# EAGLE schematic KB_Board_schematic (EAGLE 9.7.0)
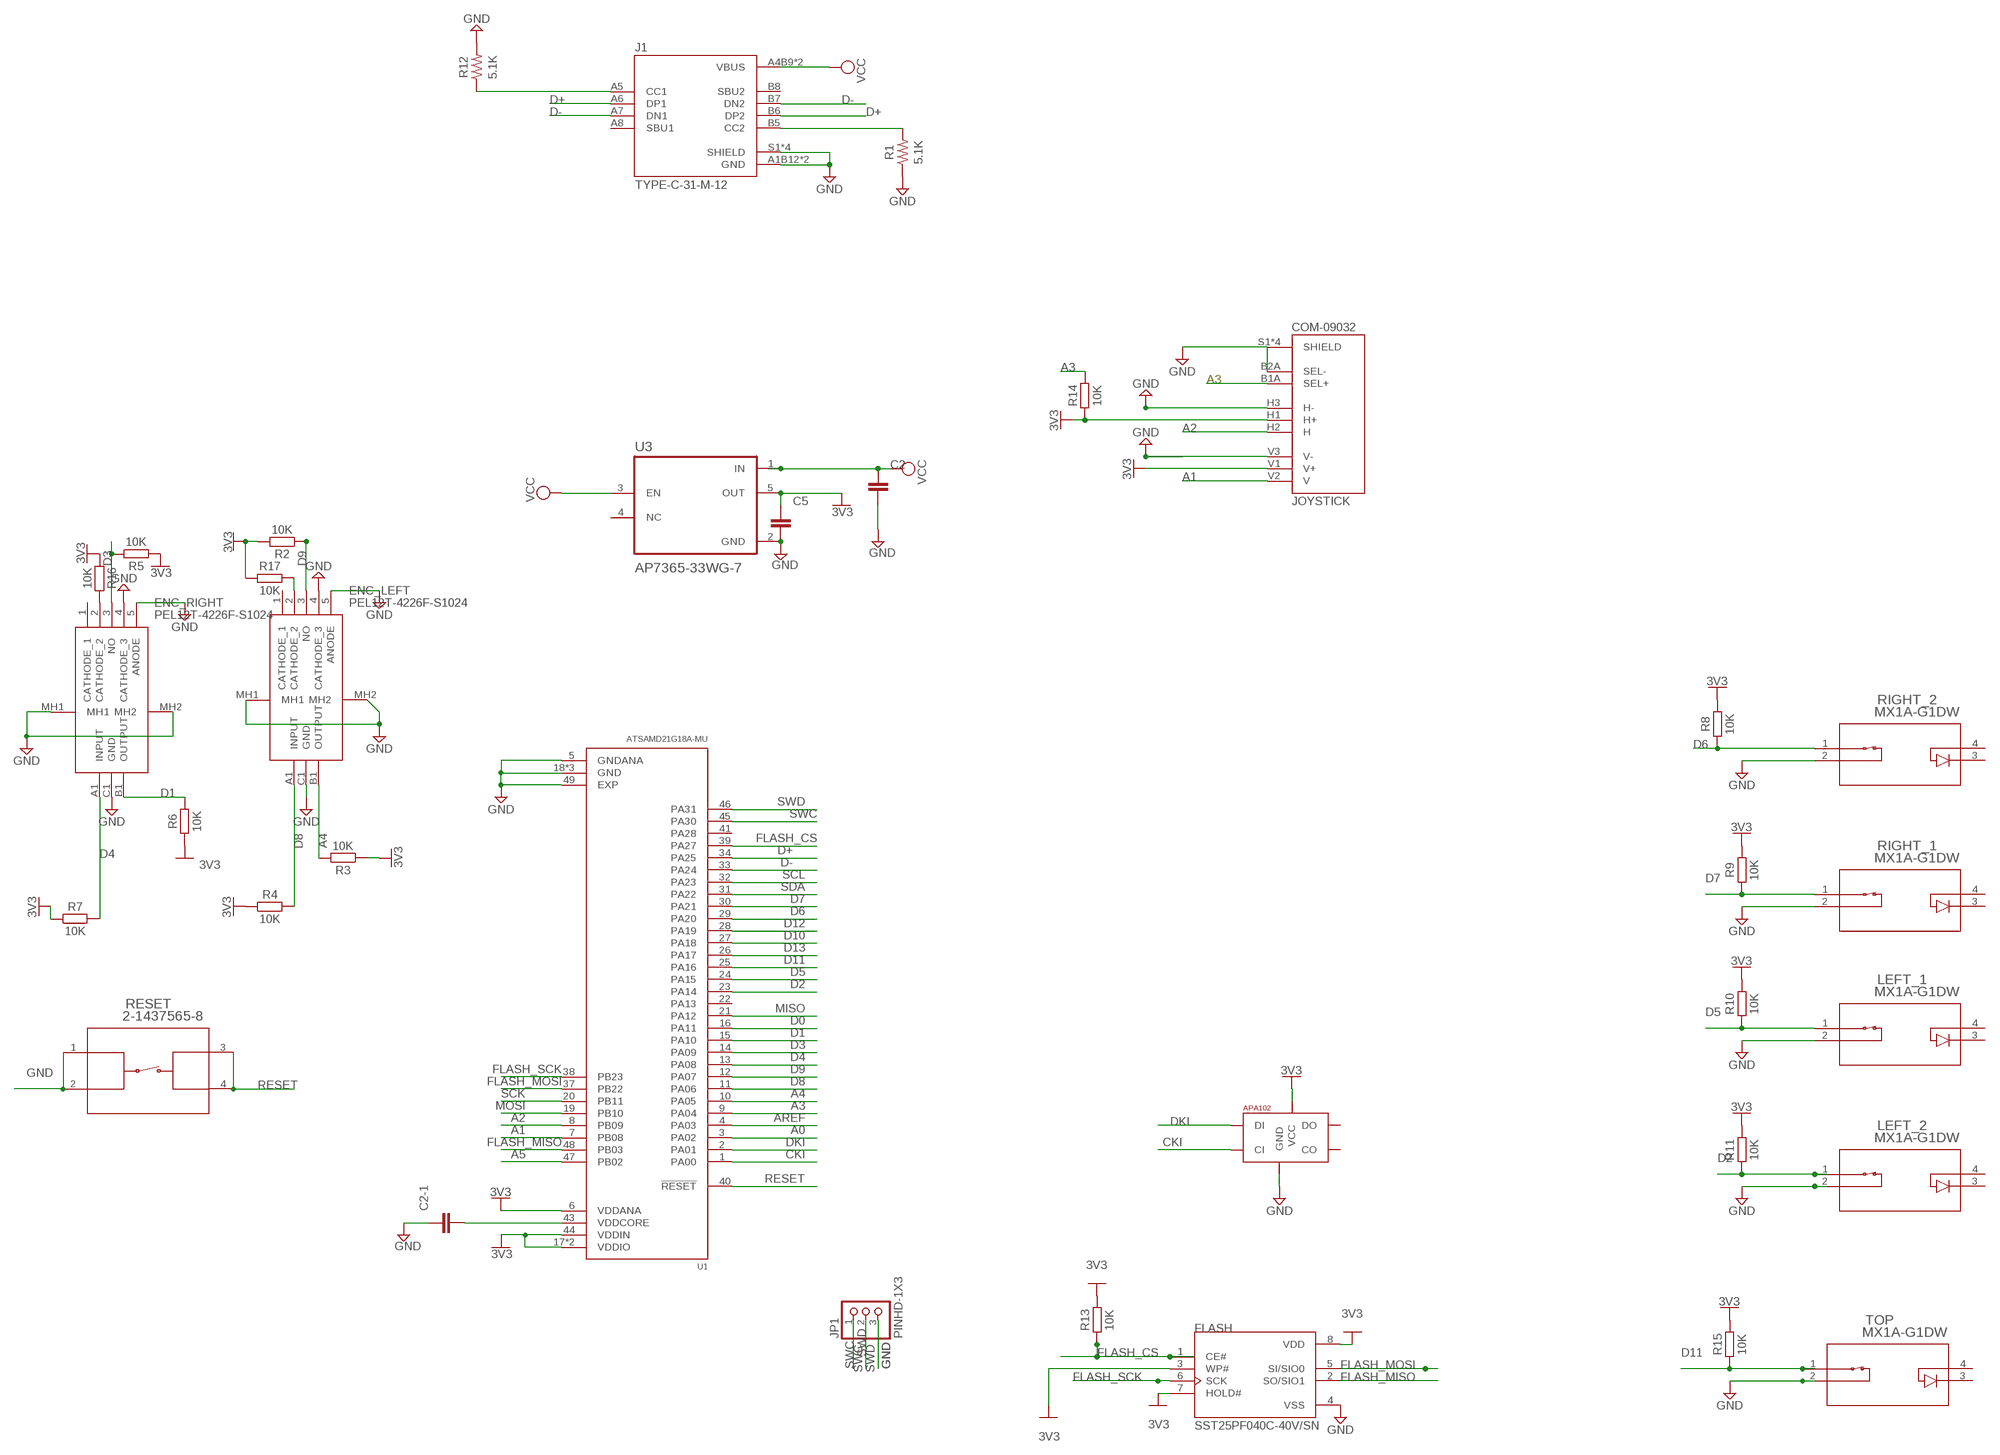
[diagram p0: schematic, sheet 1]

## Parts
C2  C_CHIP-0805(2012-METRIC)  [CAPC2012X110]
C2-1  C_CHIP-0805(2012-METRIC)  [CAPC2012X110]
C5  C_CHIP-0805(2012-METRIC)  [CAPC2012X110]
ENC_LEFT  PEL12T-4226F-S1024  [PEL12T4226FS1024]
ENC_RIGHT  PEL12T-4226F-S1024  [PEL12T4226FS1024]
FLASH  SST25PF040C-40V/SN  [SOIC8]
J1  TYPE-C-31-M-12  [HRO_TYPE-C-31-M-12]
JOYSTICK  COM-09032  [XDCR_COM-09032]
JP1  PINHD-1X3  [1X03]
LEFT_1  MX1A-G1DW  [MX1A-G1DW_CHY]
LEFT_2  MX1A-G1DW  [MX1A-G1DW_CHY]
R1  5.1K  R-US_CHIP-0402(1005-METRIC)  [RESC1005X40]
R2  10K  R_CHIP-0603(1608-METRIC)  [RESC1608X60]
R3  10K  R_CHIP-0603(1608-METRIC)  [RESC1608X60]
R4  10K  R_CHIP-0603(1608-METRIC)  [RESC1608X60]
R5  10K  R_CHIP-0603(1608-METRIC)  [RESC1608X60]
R6  10K  R_CHIP-0603(1608-METRIC)  [RESC1608X60]
R7  10K  R_CHIP-0603(1608-METRIC)  [RESC1608X60]
R8  10K  R_CHIP-0603(1608-METRIC)  [RESC1608X60]
R9  10K  R_CHIP-0603(1608-METRIC)  [RESC1608X60]
R10  10K  R_CHIP-0603(1608-METRIC)  [RESC1608X60]
R11  10K  R_CHIP-0603(1608-METRIC)  [RESC1608X60]
R12  5.1K  R-US_CHIP-0402(1005-METRIC)  [RESC1005X40]
R13  10K  R_CHIP-0603(1608-METRIC)  [RESC1608X60]
R14  10K  R_CHIP-0603(1608-METRIC)  [RESC1608X60]
R15  10K  R_CHIP-0603(1608-METRIC)  [RESC1608X60]
R16  10K  R_CHIP-0603(1608-METRIC)  [RESC1608X60]
R17  10K  R_CHIP-0603(1608-METRIC)  [RESC1608X60]
RESET  2-1437565-8  [SW4_2-1437565-7]
RIGHT_1  MX1A-G1DW  [MX1A-G1DW_CHY]
RIGHT_2  MX1A-G1DW  [MX1A-G1DW_CHY]
TOP  MX1A-G1DW  [MX1A-G1DW_CHY]
U1  ATSAMD21G18A-MU  [QFN50P700X700X90-49N]
U3  AP7365-33WG-7  [SOT95P285X140-5N]
U$1  APA1022020  [APA102_2020]

## Nets
3V3: C5.1 FLASH.3(WP#) FLASH.7(HOLD#) FLASH.8(VDD) JOYSTICK.H1(H+) JOYSTICK.V1(V+) R2.2 R3.1 R4.1 R5.2 R6.1 R7.1 R8.2 R9.2 R10.2 R11.2 R13.2 R14.1 R15.2 R16.2 R17.2 U1.6(VDDANA) U1.17(VDDIO) U1.36(VDDIO) U1.44(VDDIN) U3.5(OUT) U$1.V_CC(VCC)
A0: U1.3(PA02)
A1: JOYSTICK.V2(V) U1.7(PB08)
A2: JOYSTICK.H2(H) U1.8(PB09)
A3: JOYSTICK.B1A(SEL+) R14.2 U1.9(PA04)
A4: ENC_LEFT.B1(OUTPUT) R3.2 U1.10(PA05)
A5: U1.47(PB02)
AREF: U1.4(PA03)
CKI: U1.1(PA00) U$1.C_IN(CI)
D0: U1.16(PA11)
D1: ENC_RIGHT.B1(OUTPUT) R6.2 U1.15(PA10)
D2: LEFT_2.1 R11.1 U1.23(PA14)
D3: ENC_RIGHT.3(NO) R5.1 U1.14(PA09)
D4: ENC_RIGHT.A1(INPUT) R7.2 U1.13(PA08)
D5: LEFT_1.1 R10.1 U1.24(PA15)
D6: R8.1 RIGHT_2.1 U1.29(PA20)
D7: R9.1 RIGHT_1.1 U1.30(PA21)
D8: ENC_LEFT.A1(INPUT) R4.2 U1.11(PA06)
D9: ENC_LEFT.3(NO) R2.1 U1.12(PA07)
D10: U1.27(PA18)
D11: R15.1 TOP.1 U1.25(PA16)
D12: U1.28(PA19)
D13: U1.26(PA17)
D+: J1.A6(DP1) J1.B6(DP2) U1.34(PA25)
D-: J1.A7(DN1) J1.B7(DN2) U1.33(PA24)
DKI: U1.2(PA01) U$1.D_IN(DI)
FLASH_CS: FLASH.1(CE#) R13.1 U1.39(PA27)
FLASH_MISO: FLASH.2(SO/SIO1) U1.48(PB03)
FLASH_MOSI: FLASH.5(SI/SIO0) U1.37(PB22)
FLASH_SCK: FLASH.6(SCK) U1.38(PB23)
GND: C2-1.1 C2.2 C5.2 ENC_LEFT.4(CATHODE_3) ENC_LEFT.5(ANODE) ENC_LEFT.C1(GND) ENC_LEFT.MH1 ENC_LEFT.MH2 ENC_RIGHT.4(CATHODE_3) ENC_RIGHT.5(ANODE) ENC_RIGHT.C1(GND) ENC_RIGHT.MH1 ENC_RIGHT.MH2 FLASH.4(VSS) J1.A1B12(GND) J1.B1A12(GND) J1.S1(SHIELD) J1.S2(SHIELD) J1.S3(SHIELD) J1.S4(SHIELD) JOYSTICK.B2A(SEL-) JOYSTICK.H3(H-) JOYSTICK.S1(SHIELD) JOYSTICK.S2(SHIELD) JOYSTICK.S3(SHIELD) JOYSTICK.S4(SHIELD) JOYSTICK.V3(V-) JP1.3 LEFT_1.2 LEFT_2.2 R1.1 R12.2 RESET.1 RESET.2 RIGHT_1.2 RIGHT_2.2 TOP.2 U1.5(GNDANA) U1.18(GND) U1.35(GND) U1.42(GND) U1.49(EXP) U3.2(GND) U$1.GND
MISO: U1.21(PA12)
MOSI: U1.19(PB10)
N$1: C2-1.2 U1.43(VDDCORE)
N$2: J1.B5(CC2) R1.2
N$3: J1.A5(CC1) R12.1
N$6: ENC_RIGHT.2(CATHODE_2) R16.1
N$7: ENC_LEFT.2(CATHODE_2) R17.1
RESET: RESET.3 RESET.4 U1.40(!RESET)
SCK: U1.20(PB11)
SCL: U1.32(PA23)
SDA: U1.31(PA22)
SWC: JP1.1 U1.45(PA30)
SWD: JP1.2 U1.46(PA31)
VCC: C2.1 J1.A4B9(VBUS) J1.B4A9(VBUS) U3.1(IN) U3.3(EN)
Unconnected: ENC_LEFT.1(CATHODE_1) ENC_RIGHT.1(CATHODE_1) J1.A8(SBU1) J1.B8(SBU2) LEFT_1.3 LEFT_1.4 LEFT_2.3 LEFT_2.4 RIGHT_1.3 RIGHT_1.4 RIGHT_2.3 RIGHT_2.4 TOP.3 TOP.4 U1.22(PA13) U1.41(PA28) U3.4(NC) U$1.CL_OUT(CO) U$1.D_OUT(DO)

## Library data of the parts
C2 C2-1 C5 = Capacitor:C: Capacitor - Generic; CATEGORY: Capacitor
ENC_LEFT ENC_RIGHT = PEL12T-4226F-S1024:PEL12T-4226F-S1024: Optical Encoder Rotary Incremental Flat 0.69oz.in Straight Digital Square Wave Through Hole PC Pin 6CPR Source: Datasheet <https://componentsearchengine.com/Datasheets/1/PEL12T-4226F-S1024.pdf>; ARROW_PART_NUMBER: PEL12T-4226F-S1024; ARROW_PRICE-STOCK: https://www.arrow.com/en/products/pel12t-4226f-s1024/bourns; DESCRIPTION: Optical Encoder Rotary Incremental Flat 0.69oz.in Straight Digital Square Wave Through Hole PC Pin 6CPR; HEIGHT: 26.5mm; MANUFACTURER_NAME: Bourns; MANUFACTURER_PART_NUMBER: PEL12T-4226F-S1024; MOUSER_PART_NUMBER: 652-PEL12T4226FS1024; MOUSER_PRICE-STOCK: https://www.mouser.co.uk/ProductDetail/Bourns/PEL12T-4226F-S1024?qs=G5few1MRhWrANgmJcE3uew%3D%3D
FLASH = Memory:SST25PF040C-40V/SN: IC FLASH 4M SPI 40MHZ 8SOIC Manufacturer's datasheet <http://ww1.microchip.com/downloads/en/DeviceDoc/SST25PF040C-4-Mbit-3.3V-SPI-Serial-Flash-Data-Sheet-DS20005397E.pdf>; CREATED_BY: PCBLayout.com; DIGIKEY_PART_NUMBER: SST25PF040C-40V/SN-ND; MANUFACTURER: Microchip Technology; MPN: SST25PF040C-40V/SN; PACKAGE: 8-SOIC
J1 = TYPE-C-31-M-12_3d:TYPE-C-31-M-12: USB Connectors 24 Receptacle 1 8.94*7.3mm RoHS; MANUFACTURER: HRO Electronics; MAXIMUM_PACKAGE_HEIGHT: 3.31mm; PARTREV: A; STANDARD: Manufacturer Recommendations
JOYSTICK = joystick:COM-09032: Thumb Joystick; MANUFACTURER: SparkFun Electronics; MAXIMUM_PACKAGE_HEIGHT: 30.1mm; PARTREV: N/A; STANDARD: Manufacturer Recommendations
JP1 = Connector:PINHD-1X3: PIN HEADER; CATEGORY: CONNECTOR; SUB-CATEGORY: PIN-HEADER
LEFT_1 LEFT_2 RIGHT_1 RIGHT_2 TOP = mihai:MX1A-G1DW; BUILT_BY: EMA_Cory; COPYRIGHT: Copyright (C) 2018 Accelerated Designs. All rights reserved; DATASHEET: https://media.digikey.com/pdf/Data%20Sheets/Cherry%20PDFs/MX%20Series.pdf; MANUFACTURER_PART_NUMBER: MX1A-G1DW; SOURCELIBRARY: Cherry_2020-06-25; VENDOR: Cherry
R1 R12 = Resistor:R-US: Resistor Fixed - ANSI; CATEGORY: Resistor; SUB-CATEGORY: Fixed
R2-R11 R13-R17 = Resistor:R: Resistor Fixed - Generic; CATEGORY: Resistor; SUB-CATEGORY: Fixed
RESET = Switches:2-1437565-8; CATEGORY: Tactile Switches; DATASHEET: https://www.te.com/commerce/DocumentDelivery/DDEController?Action=showdoc&DocId=Customer+Drawing%7F2-1437565-7%7FV%7Fpdf%7FEnglish%7FENG_CD_2-1437565-7_V.pdf%7F2-1437565-7; DESCRIPTION: FSM2JSMAA=TACTILE 260G FORCE S; MANUFACTURER_PART_NUMBER: FSM2JSMAA; PART_STATUS: active; SERIES: Alcoswitch FSMJSMA; VENDOR: TE Connectivity
U1 = ATSAMD21G18A-MU_3d:ATSAMD21G18A-MU: Cortex-M0+, 256KB FLASH, 32KB SRAM, USB, DMA, T&R - 48QFN IND TEMP, GREEN, 1.6-3.6V, 48MHz/ QFN (ZA) Check prices <https://pricing.snapeda.com/search/part/ATSAMD21G18A-MU/?ref=eda>; AVAILABILITY: Good; DESCRIPTION: ARM® Cortex®-M0+ SAM D21G Microcontroller IC 32-Bit 48MHz 256KB (256K x 8) FLASH 48-QFN (7x7); MF: Microchip; MP: ATSAMD21G18A-MU; PACKAGE: QFN-48 Microchip; PRICE: None; PURCHASE-URL: https://pricing.snapeda.com/search/part/ATSAMD21G18A-MU/?ref=eda
U3 = AP7365-33WG-7 (1):AP7365-33WG-7: None; MANUFACTURER: Diodes Inc.; PACKAGE: SOT95P285X140-5N
U$1 = jos-ph:APA102: APA102C 5050 RGB LED -- Adafruit DotStar Single LED Pixel Product Page: https://www.adafruit.com/products/2343 Datasheet: https://cdn-shop.adafruit.com/product-files/2343/APA102C.pdf